# EAGLE design Power Controller 2.1 (EAGLE 6.4)
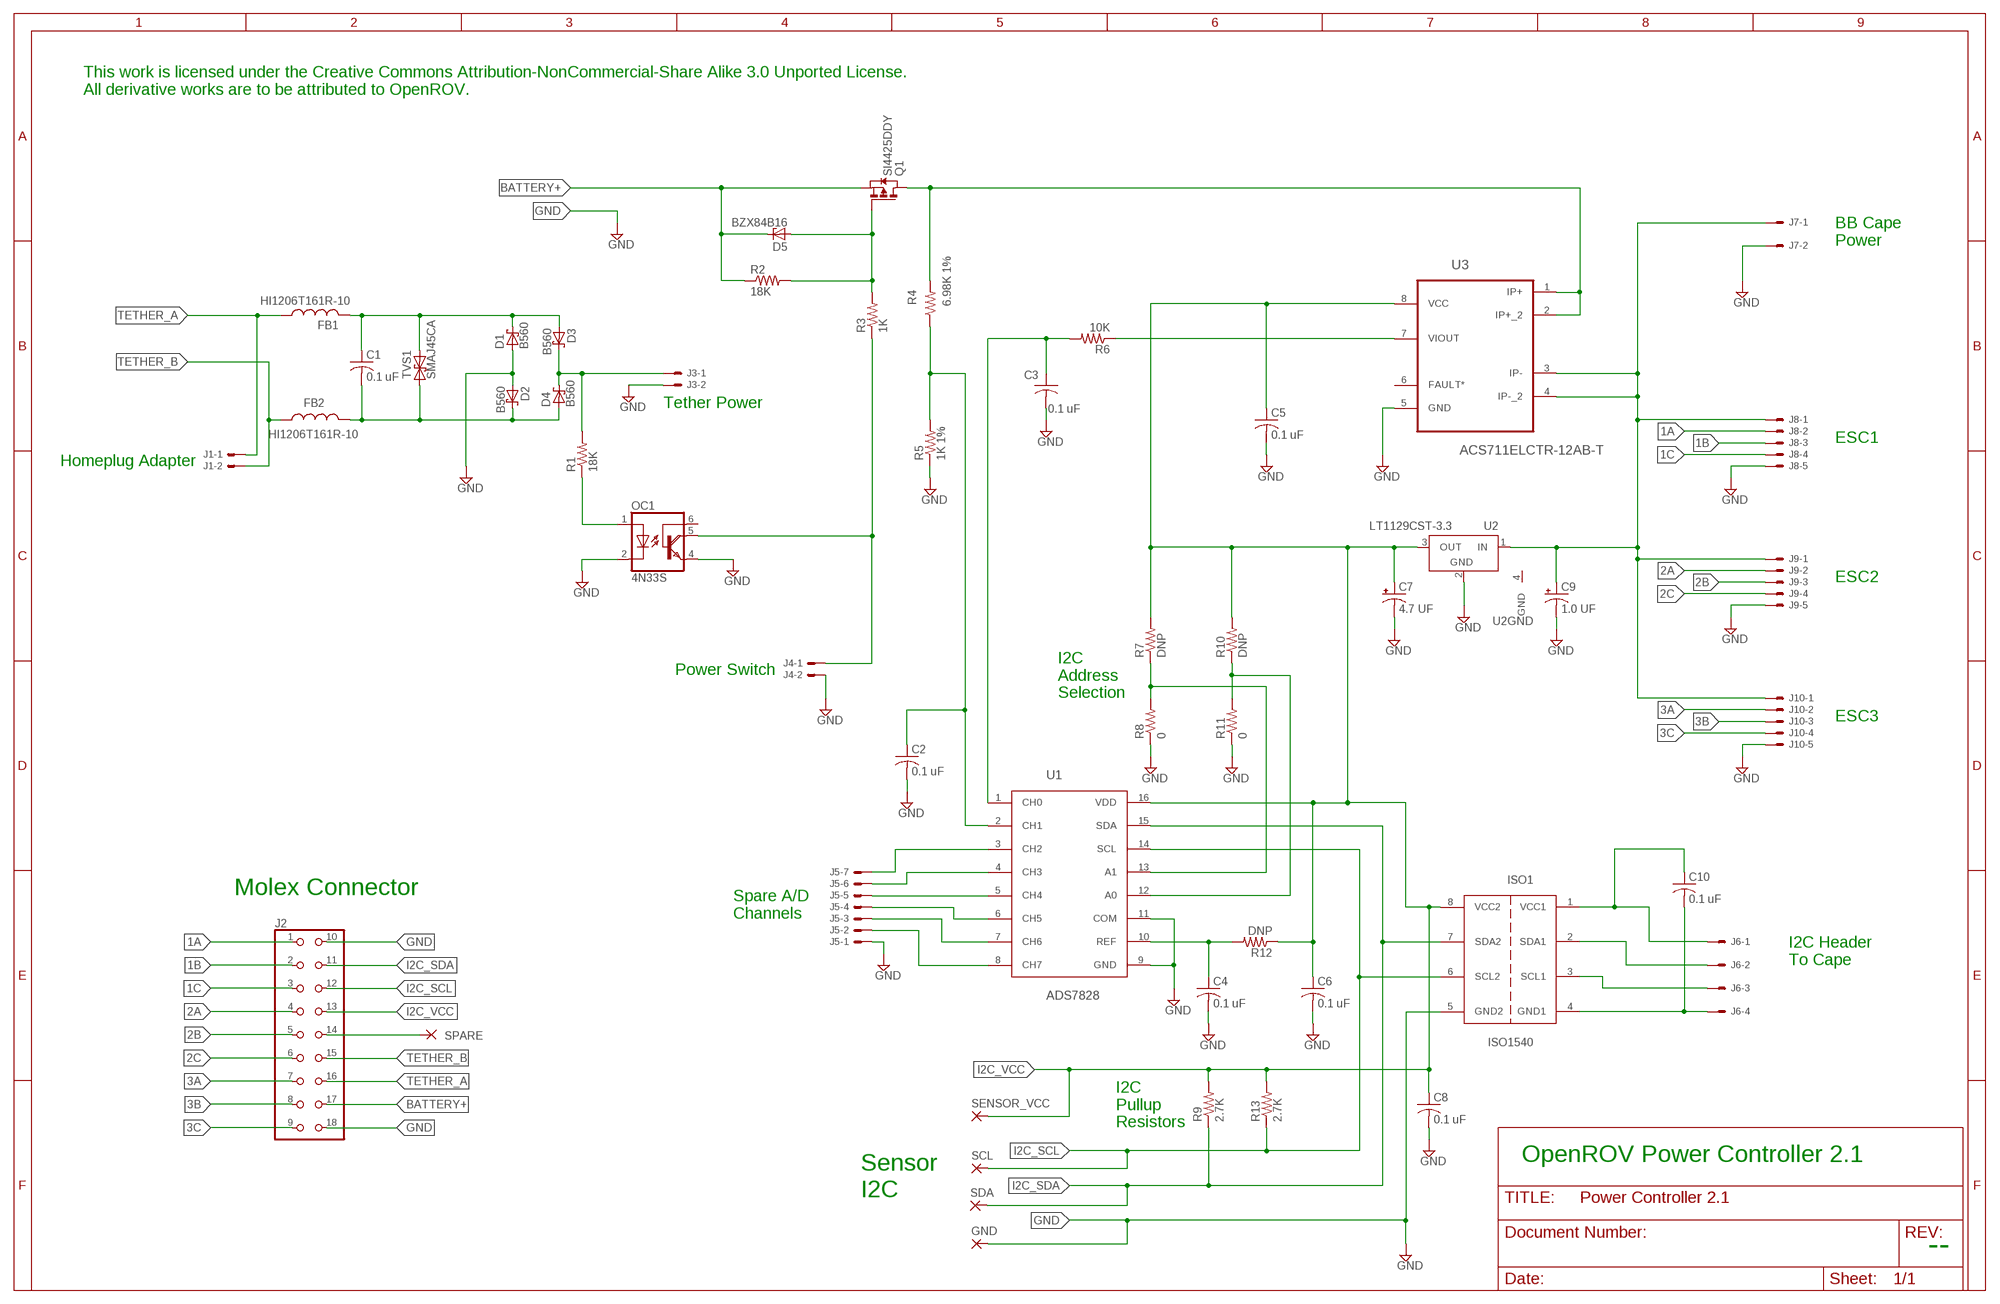
[diagram p0: schematic, sheet 1]

## Parts
C1  0.1 uF  C-USC0805K  [C0805K]
C2  0.1 uF  C-USC0805K  [C0805K]
C3  0.1 uF  C-USC0805K  [C0805K]
C4  0.1 uF  C-USC0805K  [C0805K]
C5  0.1 uF  C-USC0805K  [C0805K]
C6  0.1 uF  C-USC0805K  [C0805K]
C7  4.7 UF  CPOL-USA/3216-18R  [A/3216-18R]
C8  0.1 uF  C-USC0805K  [C0805K]
C9  1.0 UF  CPOL-USA/3216-18R  [A/3216-18R]
C10  0.1 uF  C-USC0805K  [C0805K]
D1  B560  SCHOTTKY-DIODESMC  [SMC]
D2  B560  SCHOTTKY-DIODESMC  [SMC]
D3  B560  SCHOTTKY-DIODESMC  [SMC]
D4  B560  SCHOTTKY-DIODESMC  [SMC]
D5  BZX84B16  BZX84CSMD  [TO236]
FB1  HI1206T161R-10  FERRITESIZE_1206  [R1206]
FB2  HI1206T161R-10  FERRITESIZE_1206  [R1206]
GND  1,6/0,9  [1,6/0,9]
ISO1  ISO1540  [SO8]
J1  22-23-2021  [22-23-2021]
J2  MINI-FIT-JR-18  [MINI-FIT-JR-18-PEGS]
J3  KK-156-2  [KK-156-2]
J4  22-23-2021  [22-23-2021]
J5  22-23-2071  [22-23-2071]
J6  22-23-2041  [22-23-2041]
J7  KK-156-2  [KK-156-2]
J8  ESC_PADSCUSTOM  [ESC-PADS]
J9  ESC_PADSCUSTOM  [ESC-PADS]
J10  ESC_PADSCUSTOM  [ESC-PADS]
OC1  4N33S  [DIL6-SMD]
Q1  SI4425DDY  PMOS-SO8  [SO8]
R1  18K  R-US_R0805  [R0805]
R2  18K  R-US_R0805  [R0805]
R3  1K  R-US_R0805  [R0805]
R4  6.98K 1%  R-US_R0805  [R0805]
R5  1K 1%  R-US_R0805  [R0805]
R6  10K  R-US_R0805  [R0805]
R7  DNP  R-US_R0805  [R0805]
R8  0  R-US_R0805  [R0805]
R9  2.7K  R-US_R0805  [R0805]
R10  DNP  R-US_R0805  [R0805]
R11  0  R-US_R0805  [R0805]
R12  DNP  R-US_R0805  [R0805]
R13  2.7K  R-US_R0805  [R0805]
SCL  1,6/0,9  [1,6/0,9]
SDA  1,6/0,9  [1,6/0,9]
SENSOR_VCC  1,6/0,9  [1,6/0,9]
SPARE  1,6/0,9  [1,6/0,9]
TVS1  SMAJ45CA  TVS-BIDIRDO214-AC  [DO214AC]
U1  ADS7828  [SSOP16]
U2  LT1129CST-3.3  LT1129CST5  [SOT223]
U3  ACS711ELCTR-12AB-T  ACS711  [SOIC127P600X175-8N]

## Nets
1A [ESC]: J2.1 J8.2
1B [ESC]: J2.2 J8.3
1C [ESC]: J2.3 J8.4
2A [ESC]: J2.4 J9.2
2B [ESC]: J2.5 J9.3
2C [ESC]: J2.6 J9.4
3A [ESC]: J2.7 J10.2
3B [ESC]: J2.8 J10.3
3C [ESC]: J2.9 J10.4
BATTERY+ [Power]: D5.C J2.17 Q1.1(S) Q1.2(S) Q1.3(S) R2.1
GND: C2.2 C3.2 C4.2 C5.2 C6.2 C7.- C8.2 C9.- D1.A D2.A GND.1(P) ISO1.5(GND2) J2.10 J2.18 J3.2 J4.2 J5.1 J7.2 J8.5 J9.5 J10.5 OC1.2(C) OC1.4(E) R5.1 R8.1 R11.1 U1.9(GND) U1.11(COM) U2.2(GND) U3.5(GND)
I2C_SCL: ISO1.6(SCL2) J2.12 R13.1 SCL.1(P) U1.14(SCL)
I2C_SDA: ISO1.7(SDA2) J2.11 R9.1 SDA.1(P) U1.15(SDA)
I2C_VCC: C5.1 C6.1 C7.+ C8.1 ISO1.8(VCC2) J2.13 R7.2 R9.2 R10.2 R12.1 R13.2 SENSOR_VCC.1(P) U1.16(VDD) U2.3(OUT) U3.8(VCC)
N$1: J4.1 OC1.5(COL) R3.1
N$2: C10.2 ISO1.4(GND1) J6.4
N$3: ISO1.3(SCL1) J6.3
N$4: ISO1.2(SDA1) J6.2
N$5: C10.1 ISO1.1(VCC1) J6.1
N$6: J5.7 U1.3(CH2)
N$7: D5.A Q1.4(G) R2.2 R3.2
N$8: C3.1 R6.2 U1.1(CH0)
N$9: J5.6 U1.4(CH3)
N$10: R7.1 R8.2 U1.13(A1)
N$11: R10.1 R11.2 U1.12(A0)
N$12: J5.5 U1.5(CH4)
N$13: J5.4 U1.6(CH5)
N$14 [Power]: Q1.5(D) Q1.6(D) Q1.7(D) Q1.8(D) R4.2 U3.1(IP+) U3.2(IP+_2)
N$15 [Tether]: C1.1 D1.C D3.A FB1.2 TVS1.C
N$16 [Tether]: C1.2 D2.C D4.A FB2.2 TVS1.A
N$17: OC1.1(A) R1.1
N$18: C2.1 R4.1 R5.2 U1.2(CH1)
N$19: J5.3 U1.7(CH6)
N$20: J5.2 U1.8(CH7)
N$21: C4.1 R12.2 U1.10(REF)
N$22: R6.1 U3.7(VIOUT)
SPARE: J2.14 SPARE.1(P)
TETHER_A [Tether]: FB1.1 J1.1 J2.16
TETHER_B [Tether]: FB2.1 J1.2 J2.15
TETHER_POWER [Tether]: D3.C D4.C J3.1 R1.2
V_BAT_SWITCHED [Power]: C9.+ J7.1 J8.1 J9.1 J10.1 U2.1(IN) U3.3(IP-) U3.4(IP-_2)
Unconnected: OC1.6(B) U3.6(FAULT*)

## Notes on the sheet
- This work is licensed under the Creative Commons Attribution-NonCommercial-Share Alike 3.0 Unported License.
  All derivative works are to be attributed to OpenROV.
- BB Cape
  Power
- Tether Power
- ESC1
- Homeplug Adapter
- ESC2
- Power Switch
- I2C
  Address
  Selection
- ESC3
- Molex Connector
- Spare A/D
  Channels
- I2C Header
  To Cape
- I2C
  Pullup
  Resistors
- OpenROV Power Controller 2.1
- Sensor
  I2C
- --

## Power pins joined to a net without a drawn wire
GND: U2.4(GND)

## Library data of the parts
C1-C6 C8 C10 = rcl:C-US: CAPACITOR, American symbol
C7 C9 = resistor:CPOL-US: POLARIZED CAPACITOR, American symbol
D1-D4 = diode:SCHOTTKY-DIODE: Schottky Diode
D5 = diode:BZX84CSMD: Z DIODE
FB1 FB2 = Walts_Generic_Parts:FERRITE: Generic Surface Mount Ferrite Chip
GND SCL SDA SENSOR_VCC SPARE = wirepad:1,6/0,9: THROUGH-HOLE PAD
ISO1 = OpenROV_Library:ISO1540: I2C Opto-Isolator
J1 J4 = con-molex:22-23-2021: .100" (2.54mm) Center Header - 2 Pin; MF: MOLEX; MPN: 22-23-2021; OC_FARNELL: 1462926; OC_NEWARK: 25C3832
J2 = OpenROV_Library:MINI-FIT-JR-18: Molex Mini-Fit JR 18-position
J3 J7 = con-molex:KK-156-2: KK 156 HEADER Source: http://www.molex.com/pdm_docs/sd/026604100_sd.pdf; OC_FARNELL: unknown; OC_NEWARK: unknown
J5 = con-molex:22-23-2071: .100" (2.54mm) Center Header - 7 Pin; MF: MOLEX; MPN: 22-23-2071; OC_FARNELL: 1654534; OC_NEWARK: 56H0445
J6 = con-molex:22-23-2041: .100" (2.54mm) Center Header - 4 Pin; MF: MOLEX; MPN: 22-23-2041; OC_FARNELL: 1462920; OC_NEWARK: 38C0355
J8-J10 = OpenROV_Library:ESC_PADS: KK 156 HEADER Source: http://www.molex.com/pdm_docs/sd/026604100_sd.pdf
OC1 = OpenROV_Library:4N33: MOTOROLA OPTO COUPLER
Q1 = OpenROV_Library:PMOS-SO8: MOS FET
R1-R13 = rcl:R-US_: RESISTOR, American symbol
TVS1 = Walts_Generic_Parts:TVS-BIDIR
U1 = OpenROV_Library:ADS7828
U2 = linear-technology:LT1129CST5: VOLTAGE REGULATOR with shutdown; MPN: LT1129CST-5#PBF; OC_FARNELL: 1663375; OC_NEWARK: 57M2069
U3 = OpenROV_Library:ACS711: Current Sensor by Allegro

## Net classes
0 default: width 0.254 mm, drill 0.508 mm, clearance 0.229 mm
1 ESC: width 1.676 mm, drill 0.762 mm, clearance 0.381 mm to class 0, clearance 0.381 mm
2 Power: width 2.286 mm, drill 1.016 mm, clearance 0.381 mm to class 0, clearance 0.381 mm to class 1, clearance 0.381 mm
3 Tether: width 2.032 mm, drill 1.016 mm, clearance 0.508 mm to class 0, clearance 0.508 mm to class 1, clearance 0.508 mm to class 2, clearance 0.508 mm

## Board
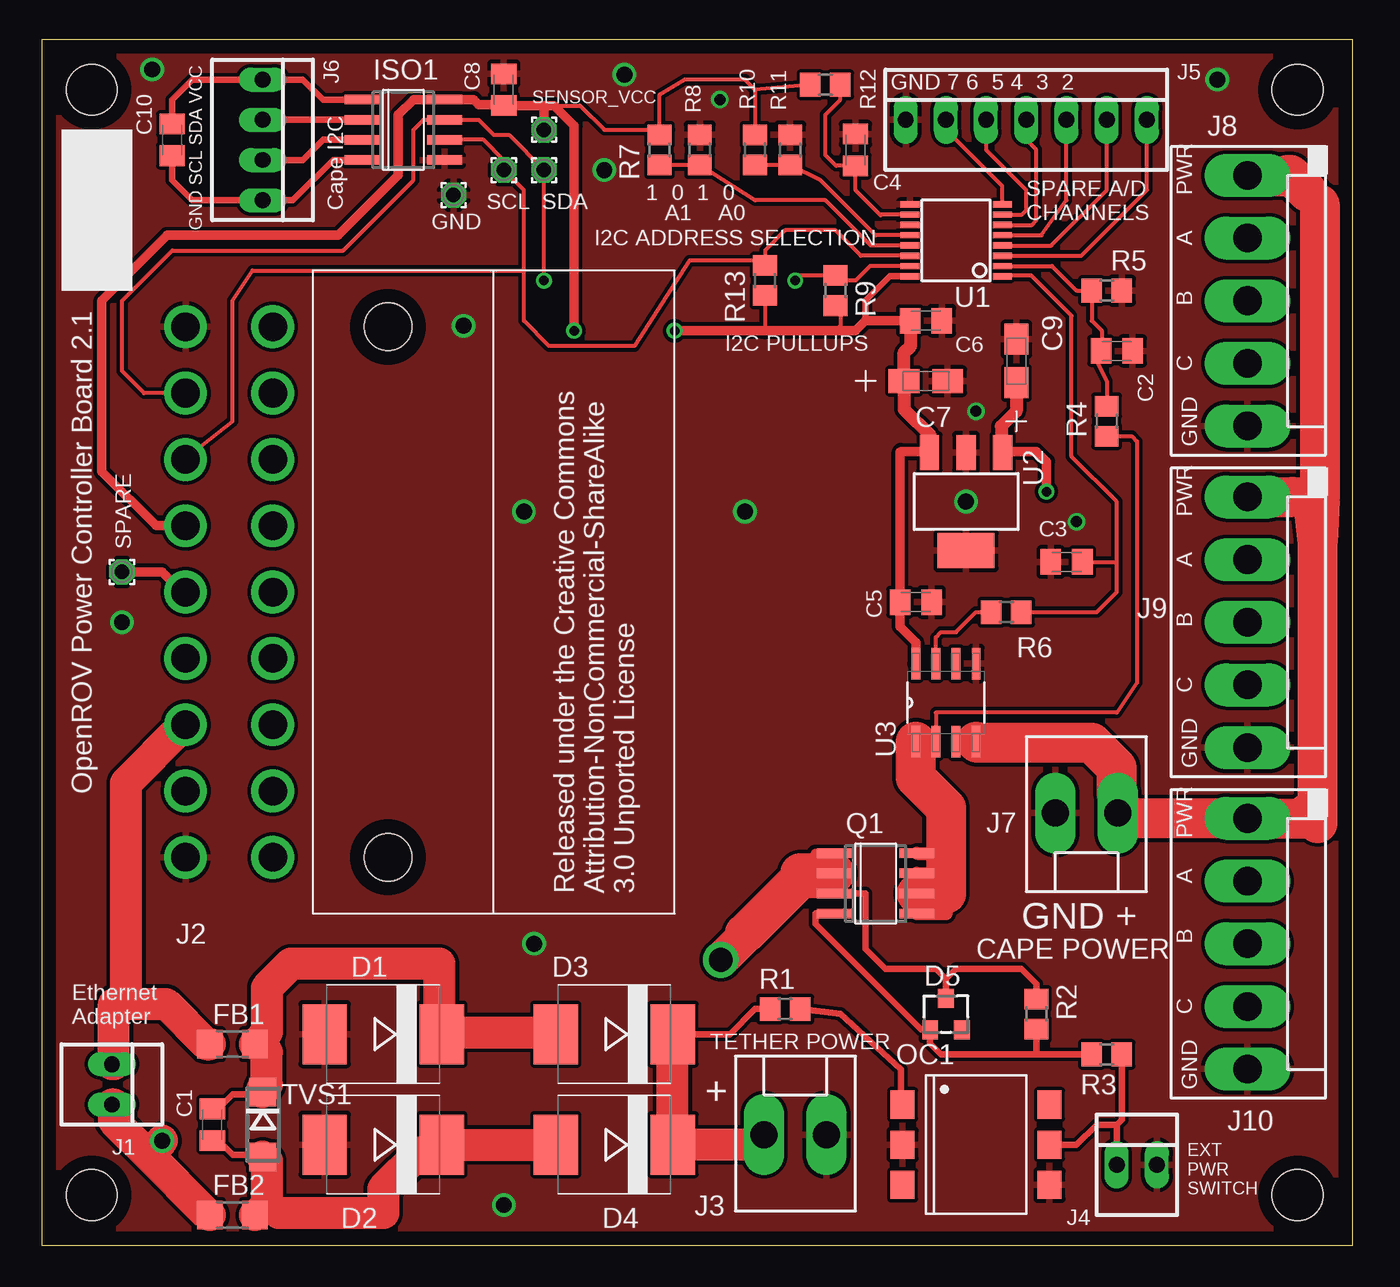
[diagram p1: board, top side]
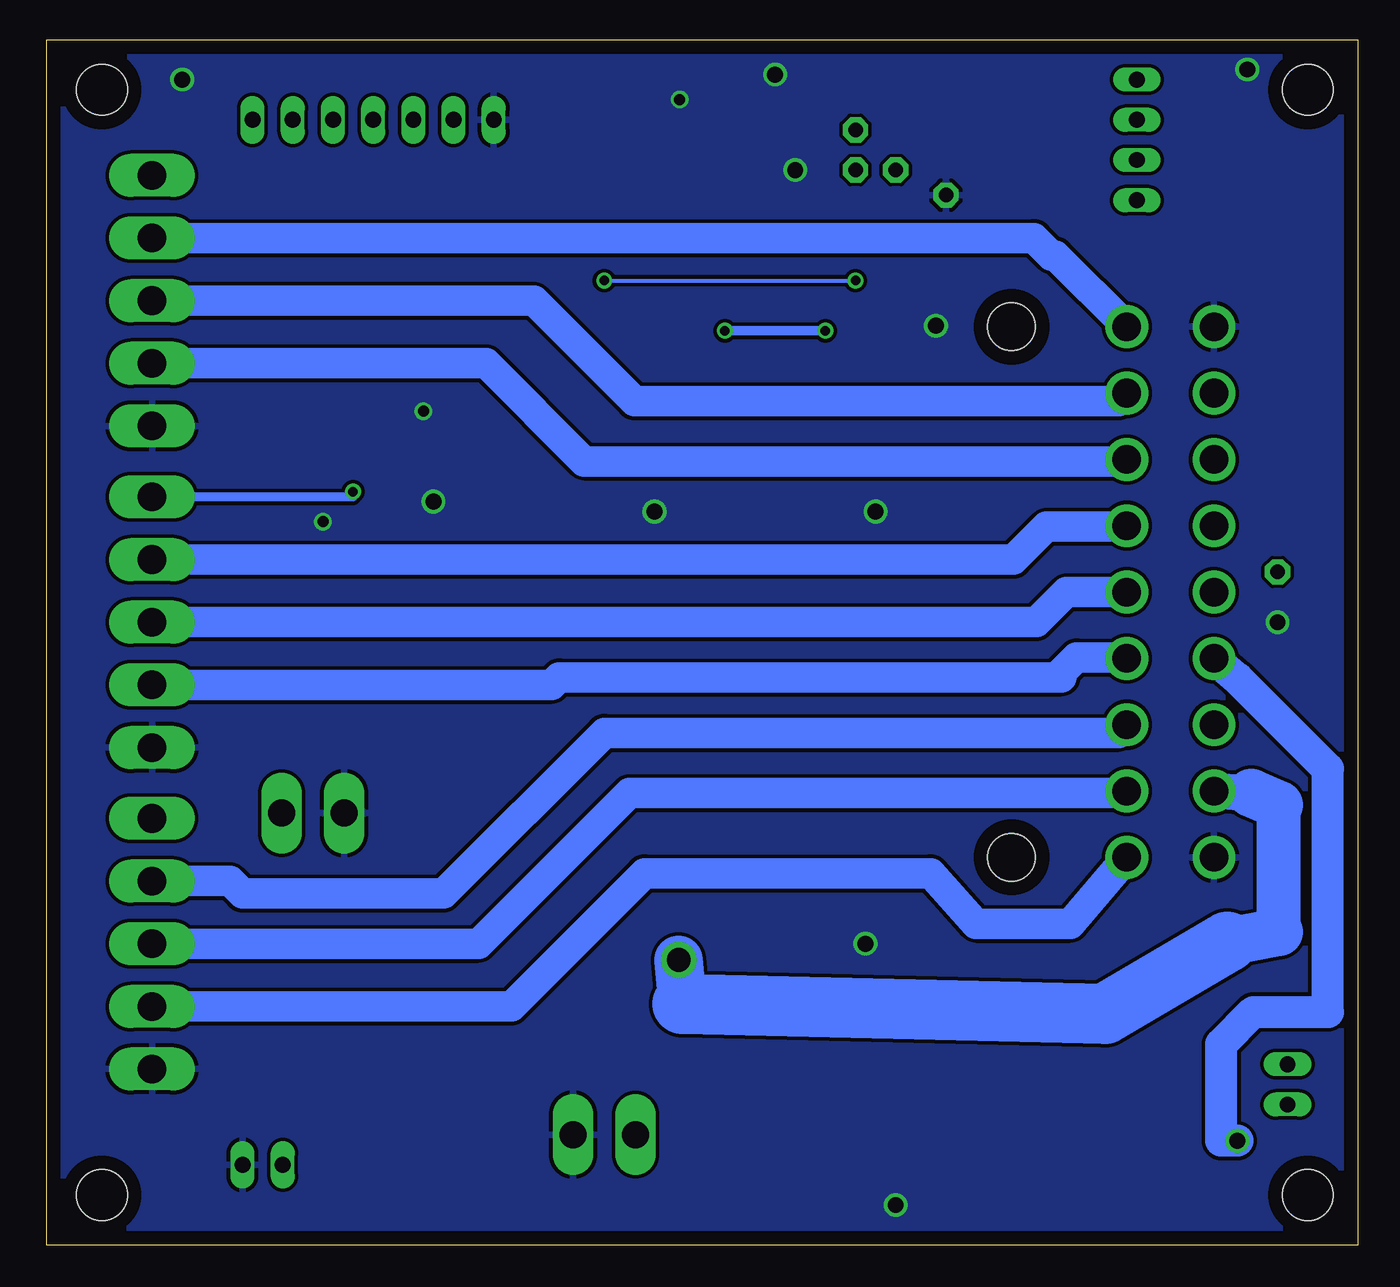
[diagram p2: board, bottom side, seen from below]

Size 82.86 x 76.19 mm. Coordinates in mm from the lower left corner, seen from the top.
Outline: 0,0 82.86,0 82.86,76.19 0,76.19 0,0
Copper layers (1*16): Top 0.035mm / dielectric 1.5mm / Bottom 0.035mm
Design rules "default *": minimum track width 10mil, minimum drill 20mil, track to track 8mil, track to pad 8mil, pad to pad 8mil, via to via 8mil, smd to smd 8mil, copper to edge 35mil, drill to drill 8mil, minimum pad ring 10mil, minimum via ring 8mil, stop-mask expansion 4mil, vias tented up to drill 0mil, thermal gap 10mil
Holes 3.2 mm at 3.17,3.17 3.17,73.03 79.38,73.03 79.38,3.17

### Footprints (pad centres in the part's own frame; a part is rotated, then mirrored left to right if it is on the bottom)
C0805K = smd 1.3 x 1.6: 1 -1,0; 2 1,0
A/3216-18R = smd 1.95 x 1.5: + 1.375,0; - -1.375,0
SMC = smd 2.8 x 3.8: A 3.7,0; C -3.7,0
TO236 = smd 1 x 1.2: A -1,-1; C 0,1; NC 1,-1
R1206 = smd 1.6 x 1.803: 1 -1.422,0; 2 1.422,0
1,6/0,9 = drill 0.914 pad 1.6 octagon: 1 0,0
SO8 = smd 0.6 x 2.2: 1 -1.905,-2.6; 2 -0.635,-2.6; 3 0.635,-2.6; 4 1.905,-2.6; 5 1.905,2.6; 6 0.635,2.6; 7 -0.635,2.6; 8 -1.905,2.6
22-23-2021 = drill 1 long: 1 -1.27,0; 2 1.27,0
MINI-FIT-JR-18-PEGS = drill 1.803: 1 0,-16.764; 2 0,-12.573; 3 0,-8.382; 4 0,-4.191; 5 0,0; 6 0,4.191; 7 0,8.382; 8 0,12.573; 9 0,16.764; 10 5.512,-16.764; 11 5.512,-12.573; 12 5.512,-8.382; 13 5.512,-4.191; 14 5.512,0; 15 5.512,4.191; 16 5.512,8.382; 17 5.512,12.573; 18 5.512,16.764 | hole 2.997: -7.29,-16.764; -7.29,16.764
KK-156-2 = drill 1.7 pad 2.184 long: 1 -1.98,0; 2 1.98,0
22-23-2071 = drill 1 long: 1 -7.62,0; 2 -5.08,0; 3 -2.54,0; 4 0,0; 5 2.54,0; 6 5.08,0; 7 7.62,0
22-23-2041 = drill 1 long: 1 -3.81,0; 2 -1.27,0; 3 1.27,0; 4 3.81,0
ESC-PADS = drill 1.803 pad 2.362 long: 1 -7.92,0; 2 -3.96,0; 3 0,0; 4 3.96,0; 5 7.92,0
DIL6-SMD = smd 1.78 x 1.52: 1 -2.54,-4.645; 2 0,-4.645; 3 2.54,-4.645; 4 2.54,4.645; 5 0,4.645; 6 -2.54,4.645
R0805 = smd 1.3 x 1.5: 1 -0.95,0; 2 0.95,0
DO214AC = smd 1.8 x 1.7: A 2.05,0; C -2.05,0
SSOP16 = smd 0.4 x 1.2: 1 -2.275,-2.925; 2 -1.625,-2.925; 3 -0.975,-2.925; 4 -0.325,-2.925; 5 0.325,-2.925; 6 0.975,-2.925; 7 1.625,-2.925; 8 2.275,-2.925; 9 2.275,2.925; 10 1.625,2.925; 11 0.975,2.925; 12 0.325,2.925; 13 -0.325,2.925; 14 -0.975,2.925; 15 -1.625,2.925; 16 -2.275,2.925
SOT223 = smd 1.219 x 2.235: 1 -2.311,-3.099; 2 0,-3.099; 3 2.311,-3.099 | smd 3.6 x 2.2: 4 0,3.099
SOIC127P600X175-8N = smd 1.981 x 0.559: 1 -2.464,1.905; 2 -2.464,0.635; 3 -2.464,-0.635; 4 -2.464,-1.905; 5 2.464,-1.905; 6 2.464,-0.635; 7 2.464,0.635; 8 2.464,1.905

### Placement (x,y rotation side)
C1  10.79,7.62 270 top
C2  67.94,56.52 0 top
C3  64.77,43.18 180 top
C4  51.44,69.22 90 top
C5  55.24,40.64 0 top
C6  55.88,58.42 0 top
C7  55.88,54.61 180 top
C8  29.21,73.03 90 top
C9  61.59,55.88 270 top
C10  8.26,69.85 270 top
D1  21.59,13.34 180 top
D2  21.59,6.35 180 top
D3  36.2,13.34 180 top
D4  36.2,6.35 180 top
D5  57.15,14.61 0 top
FB1  12.06,12.7 0 top
FB2  12.06,1.91 0 top
GND  26.04,66.36 0 top
ISO1  22.86,70.48 270 top
J1  4.45,10.16 270 top
J2  14.61,41.27 180 top
J3  47.62,6.99 0 top
J4  69.22,5.08 0 top
J5  62.23,71.12 0 top
J6  13.97,69.85 270 top
J7  66.04,27.3 180 top
J8  76.2,59.69 270 top
J9  76.2,39.37 270 top
J10  76.2,19.05 270 top
OC1  59.05,6.35 270 top
Q1  52.7,22.86 270 top
R1  46.99,14.92 180 top
R2  62.87,14.61 270 top
R3  67.31,12.06 180 top
R4  67.31,52.07 270 top
R5  67.31,60.33 180 top
R6  60.96,40.01 0 top
R7  39.05,69.22 90 top
R8  41.59,69.22 270 top
R9  50.16,60.33 270 top
R10  45.09,69.22 90 top
R11  47.31,69.22 270 top
R12  49.53,73.34 0 top
R13  45.72,60.96 270 top
SCL  29.21,67.94 0 top
SDA  31.75,67.94 0 top
SENSOR_VCC  31.75,70.48 0 top
SPARE  5.08,42.55 0 top
TVS1  13.97,7.62 270 top
U1  57.78,63.5 90 top
U2  58.42,46.99 180 top
U3  57.15,34.29 90 top

### Tracks (layer width: path | path; a pad name or v marks a point on that pad's centre or on a via)
1A
  Bottom 1.93: J8.2 20.47,63.65 19.37,62.55 19.11,62.55 J2.1
1B
  Bottom 1.93: J8.3 52.07,59.69 45.72,53.34 15.11,53.34 J2.2
1C
  Bottom 1.93: J8.4 55.09,55.73 48.9,49.53 14.73,49.53 J2.3
2A
  Bottom 1.93: J9.2 21.76,43.33 19.68,45.4 14.67,45.4 J2.4
2B
  Bottom 1.93: J9.3 20.32,39.37 18.41,41.27 J2.5
2C
  Bottom 1.676: 14.73,37.08 J2.6
  Bottom 1.93: J9.4 50.95,35.41 50.48,35.88 18.73,35.88 18.73,36.2 17.78,37.15 14.67,37.15 J2.6
3A
  Bottom 1.93: J10.2 71.27,23.01 70.48,22.23 57.78,22.23 47.62,32.38 15.11,32.38 J2.7
3B
  Bottom 1.93: J10.3 55.56,19.05 46.04,28.57 14.73,28.57 J2.8
3C
  Bottom 1.93: J2.9 18.16,20.32 24.13,20.32 26.99,23.5 45.09,23.5 53.49,15.09 J10.4
BATTERY+  (via drill 1.5)
  Top 0.406: D5.C 57.15,16.83 | 57.15,16.83 57.78,17.46 61.91,17.46 62.87,16.51 R2.1 | Q1.3 52.07,22.23 52.07,18.73 53.34,17.46 56.52,17.46 57.15,16.83
  Top 0.61: Q1.1 48.9,24.77 48.9,23.5 | Q1.3 48.26,22.23 48.26,22.86 47.94,23.18
  Top 2.286: v42.93,18.03 44.45,19.56 44.45,19.68
  Top 2.54: Q1.2 48.9,23.5 47.94,23.5 47.94,23.18 44.45,19.68
  Bottom 1.27: 7.49,28.57 6.73,28.57
  Bottom 2.286: 7.49,28.57 8.89,28.7 J2.17
  Bottom 2.794: 5.02,19.81 5.02,27.81
  Bottom 3.048: 5.02,27.81 6.73,28.57 | 8.26,19.18 5.02,19.81 | v42.93,18.03 42.67,15.24
  Bottom 3.81: 8.26,19.18 16,14.61 42.67,15.24
GND  (via drill 0.7, 1)
  other vias: 42.86,72.39 44.45,46.35 30.48,46.35 6.99,74.3 36.83,73.98 29.21,2.54 58.42,46.99 35.56,67.94 26.67,58.1 74.3,73.66 65.41,45.72 59.05,52.7 5.08,39.37 31.11,19.05
  pour Top: -0.64,76.83 83.19,76.83 83.19,-0.64 -0.64,-0.64
  pour Bottom: -0.64,-0.64 83.19,-0.64 83.19,76.83 -0.64,76.83 -0.64,76.2
I2C_SCL
  Top 0.254: J2.12 9.09,49.73 12.06,52.07 12.06,59.69 13.34,61.59 30.48,61.59 | ISO1.6 27.94,69.85 29.21,68.58 SCL.1 30.48,66.67 30.48,61.59 | U1.14 51.77,62.52 50.16,64.14 46.99,64.14 45.72,62.87 R13.1 45.72,62.23 40.96,62.23 37.47,56.83 32.07,56.83 30.48,58.42 30.48,61.59
I2C_SDA  (via drill 0.6)
  Top 0.254: J2.11 6.48,53.85 5.08,55.24 5.08,59.69 8.26,62.87 19.05,62.87 23.5,67.31 23.5,70.48 24.13,71.12 ISO1.7 27.62,71.12 28.57,70.17 29.53,70.17 SDA.1 v31.75,60.96 | U1.15 52.35,61.88 51.44,60.96 50.48,60.96 R9.1 47.94,61.27 v47.62,60.96
  Bottom 0.254: v47.62,60.96 v31.75,60.96
I2C_VCC  (via drill 0.6)
  Top 0.254: 28.84,72.39 C8.1 | 32.38,72.03 34.02,72.03 35.56,70.48 39.69,70.48 R7.2 39.05,72.71 40.64,73.66 44.45,73.66 45.09,73.03 | 45.09,73.03 R10.2 | R9.2 50.48,59.69 50.48,58.1 50.16,57.78 | R13.2 45.72,57.78 | R12.1 45.09,73.03
  Top 0.406: U1.16 53.6,61.23 52.07,59.69 52.07,58.42
  Top 0.61: U2.3 56.03,50.16 54.29,50.16 54.24,50.12 C5.1 54.24,39.1 55.24,38.1 U3.8 | C6.1 52.07,58.42 51.44,57.78 50.16,57.78 45.72,57.78 v40.01,57.78 | v33.66,57.78 33.66,70.75 32.38,72.03 31.75,72.03 | 31.75,72.03 C8.1 | 28.84,72.39 28.53,72.07 27.62,72.07 27.3,72.39 ISO1.8 23.5,72.39 22.54,71.44 22.54,67.63 18.73,63.82 7.94,63.82 3.81,59.69 3.81,48.9 7.24,45.47 J2.13 | SENSOR_VCC.1 31.75,72.03
  Top 0.813: C6.1 54.93,58.37 54.93,56.83 54.51,56.41 C7.+ 54.51,52.81 56.2,51.12 56.2,50.18 U2.3
  Bottom 0.61: v40.01,57.78 v33.66,57.78
N$1
  Top 0.406: R3.1 68.26,7.93 67.94,7.62 | 67.94,7.62 J4.1 | OC1.5 65.41,6.35 66.67,7.62 67.94,7.62
N$2
  Top 0.406: ISO1.4 18.41,68.58 15.88,66.04 J6.4 9.53,66.04 8.26,67.31 C10.2
N$3
  Top 0.406: ISO1.3 17.78,69.85 16.51,68.58 J6.3
N$4
  Top 0.406: ISO1.2 J6.2
N$5
  Top 0.406: ISO1.1 17.78,72.39 16.51,73.66 J6.1 9.53,73.66 8.26,72.39 C10.1
N$6
  Top 0.254: J5.7 69.85,66.67 65.7,62.52 U1.3
N$7
  Top 0.406: Q1.4 48.9,20.95 48.9,20.32 55.56,13.65 56.1,13.65 D5.A 56.15,12.75 56.83,12.06 62.87,12.06 | R3.2 62.87,12.06 | R2.2 62.87,12.06
N$8
  Top 0.254: 67.94,43.18 67.94,41.27 66.67,40.01 R6.2 | 67.94,43.18 67.94,46.99 65.09,49.85 65.09,58.74 62.55,61.28 60.76,61.28 U1.1 | C3.1 67.94,43.18
N$9
  Top 0.254: U1.4 63.83,63.17 63.83,63.19 67.31,66.67 J5.6
N$10
  Top 0.254: R7.1 R8.2 45.09,66.04 49.53,66.04 52.4,63.17 U1.13
N$11
  Top 0.254: U1.12 52.7,63.83 49.21,67.31 R11.2 R10.1
N$12
  Top 0.254: U1.5 63.19,63.83 64.77,66.04 J5.5
N$13
  Top 0.254: U1.6 62.57,64.47 62.87,64.77 62.87,69.22 62.23,69.85 J5.4
N$14
  Top 0.254: R4.2 68.89,51.12 69.22,50.8 69.22,35.56 67.94,33.66 56.52,33.66 U3.2
  Top 0.61: U3.1 U3.2
  Top 0.813: Q1.8 57.15,24.77 | Q1.7 57.15,23.5 | Q1.5 57.15,20.95 57.15,22.23
  Top 2.54: Q1.6 57.15,22.23 57.15,23.5 57.15,24.77 57.15,27.62 55.24,29.53 U3.1
N$15
  Top 0.406: C1.1 11.16,8.62 12.06,9.53 13.82,9.53 TVS1.C
  Top 2.032: TVS1.C 13.97,9.91 14.22,10.16 14.22,12.19 13.72,12.7 FB1.2 14.22,13.46 14.22,16.26 15.75,17.78 25.15,17.78 25.15,13.46 D1.C 26.16,13.46 32.26,13.46 D3.A
N$16
  Top 0.406: C1.2 11.16,6.62 12.06,5.71 13.82,5.71 TVS1.A
  Top 2.032: 14.22,2.54 13.72,2.03 FB2.2 | 14.22,2.54 14.22,5.33 13.97,5.59 TVS1.A | 14.22,2.54 14.99,2.03 21.59,2.03 21.59,3.56 23.88,5.84 25.15,5.84 25.15,6.35 D2.C D4.A
N$17
  Top 0.406: R1.1 50.48,14.61 54.29,11.11 54.29,9.01 OC1.1
N$18
  Top 0.254: U1.2 63.85,61.88 65.41,60.33 R5.2 66.36,58.42 66.99,57.78 66.99,56.56 C2.1 66.67,56.24 66.67,55.88 67.31,54.61 R4.1
N$19
  Top 0.254: U1.7 61.95,65.12 62.23,65.41 62.23,66.67 59.69,69.22 J5.3
N$20
  Top 0.254: U1.8 60.71,66.92 57.15,70.48 J5.2
N$21
  Top 0.254: U1.10 53.06,65.12 53.02,65.09 51.44,66.67 C4.1 50.21,68.22 49.53,68.9 49.53,71.44 50.48,72.39 R12.2
N$22
  Top 0.254: U3.7 56.52,38.42 56.83,38.73 57.78,38.73 59.05,40.01 R6.1
SPARE
  Top 0.61: J2.14 8.89,41.27 7.62,42.55 SPARE.1
TETHER_A
  Top 2.032: 5.33,15.24 4.57,15.24 4.57,11.43 J1.1 | 5.33,15.24 7.87,15.24 10.41,12.7 FB1.1 | 5.33,15.24 5.33,29.21 8.89,32.77 J2.16
TETHER_B  (via drill 1.02)
  Top 2.032: 6.73,5.71 4.57,7.87 4.57,8.89 J1.2 | 6.73,5.71 10.41,2.03 FB2.1 | v7.62,6.6 6.73,5.71
  Bottom 1.93: 1.91,30.1 2.1,30.29
  Bottom 2.032: 2.1,30.29 7.62,35.81 J2.15 | 1.91,30.1 1.91,14.73 6.6,14.73 8.64,12.7 8.64,6.6 v7.62,6.6
TETHER_POWER
  Top 0.406: 40.01,13.34 D3.C 43.5,13.34 45.09,14.92 R1.2
  Top 2.032: J3.1 45.47,6.86 45.47,6.35 D4.C 39.88,7.11 39.88,13.21 D3.C
V_BAT_SWITCHED  (via drill 0.6)
  Top 0.61: v63.5,47.62 63.5,49.53 62.87,50.16 60.81,50.16 U2.1 | U3.3 U3.4
  Top 0.813: C9.+ 61.59,52.7 60.64,51.75 60.64,50.18 U2.1
  Top 1.778: 67.94,28.57 67.94,26.75 J7.1
  Top 2.286: 80.77,65.79 80.01,66.55 | 76.2,67.56 J8.1
  Top 2.54: 80.01,27.3 80.34,26.97 | 80.64,44.45 80.64,26.67 80.34,26.97 | 80.64,44.45 80.33,47.31 79.04,47.29 J9.1 | J7.1 68.32,26.97 J10.1 80.34,26.97 | 76.2,67.56 78.68,67.56 78.74,67.63 78.93,67.63 80.01,66.55 | 80.64,44.45 80.77,47.12 80.77,65.79 | 67.94,28.57 67.94,30.16 66.36,31.75 59.13,31.75 U3.4
  Bottom 0.61: J9.1 63.5,47.31 v63.5,47.62

### Text on the board
tPlace: GND 7 6 5 4 3 2 | 1 0 1 0 | PWR | Cape I2C | A1 A0 | SPARE A/D / CHANNELS | GND SCL SDA VCC | I2C ADDRESS SELECTION | A | OpenROV Power Controller Board 2.1 | B | I2C PULLUPS | C | GND | PWR | A | B | C | GND | PWR | A | Released under the Creative Commons / Attribution-NonCommercial-ShareAlike / 3.0 Unported License | GND + | B | CAPE POWER | C | Ethernet / Adapter | TETHER POWER | GND | + | EXT / PWR / SWITCH